# Altium project RMCBackplane.PrjPcb
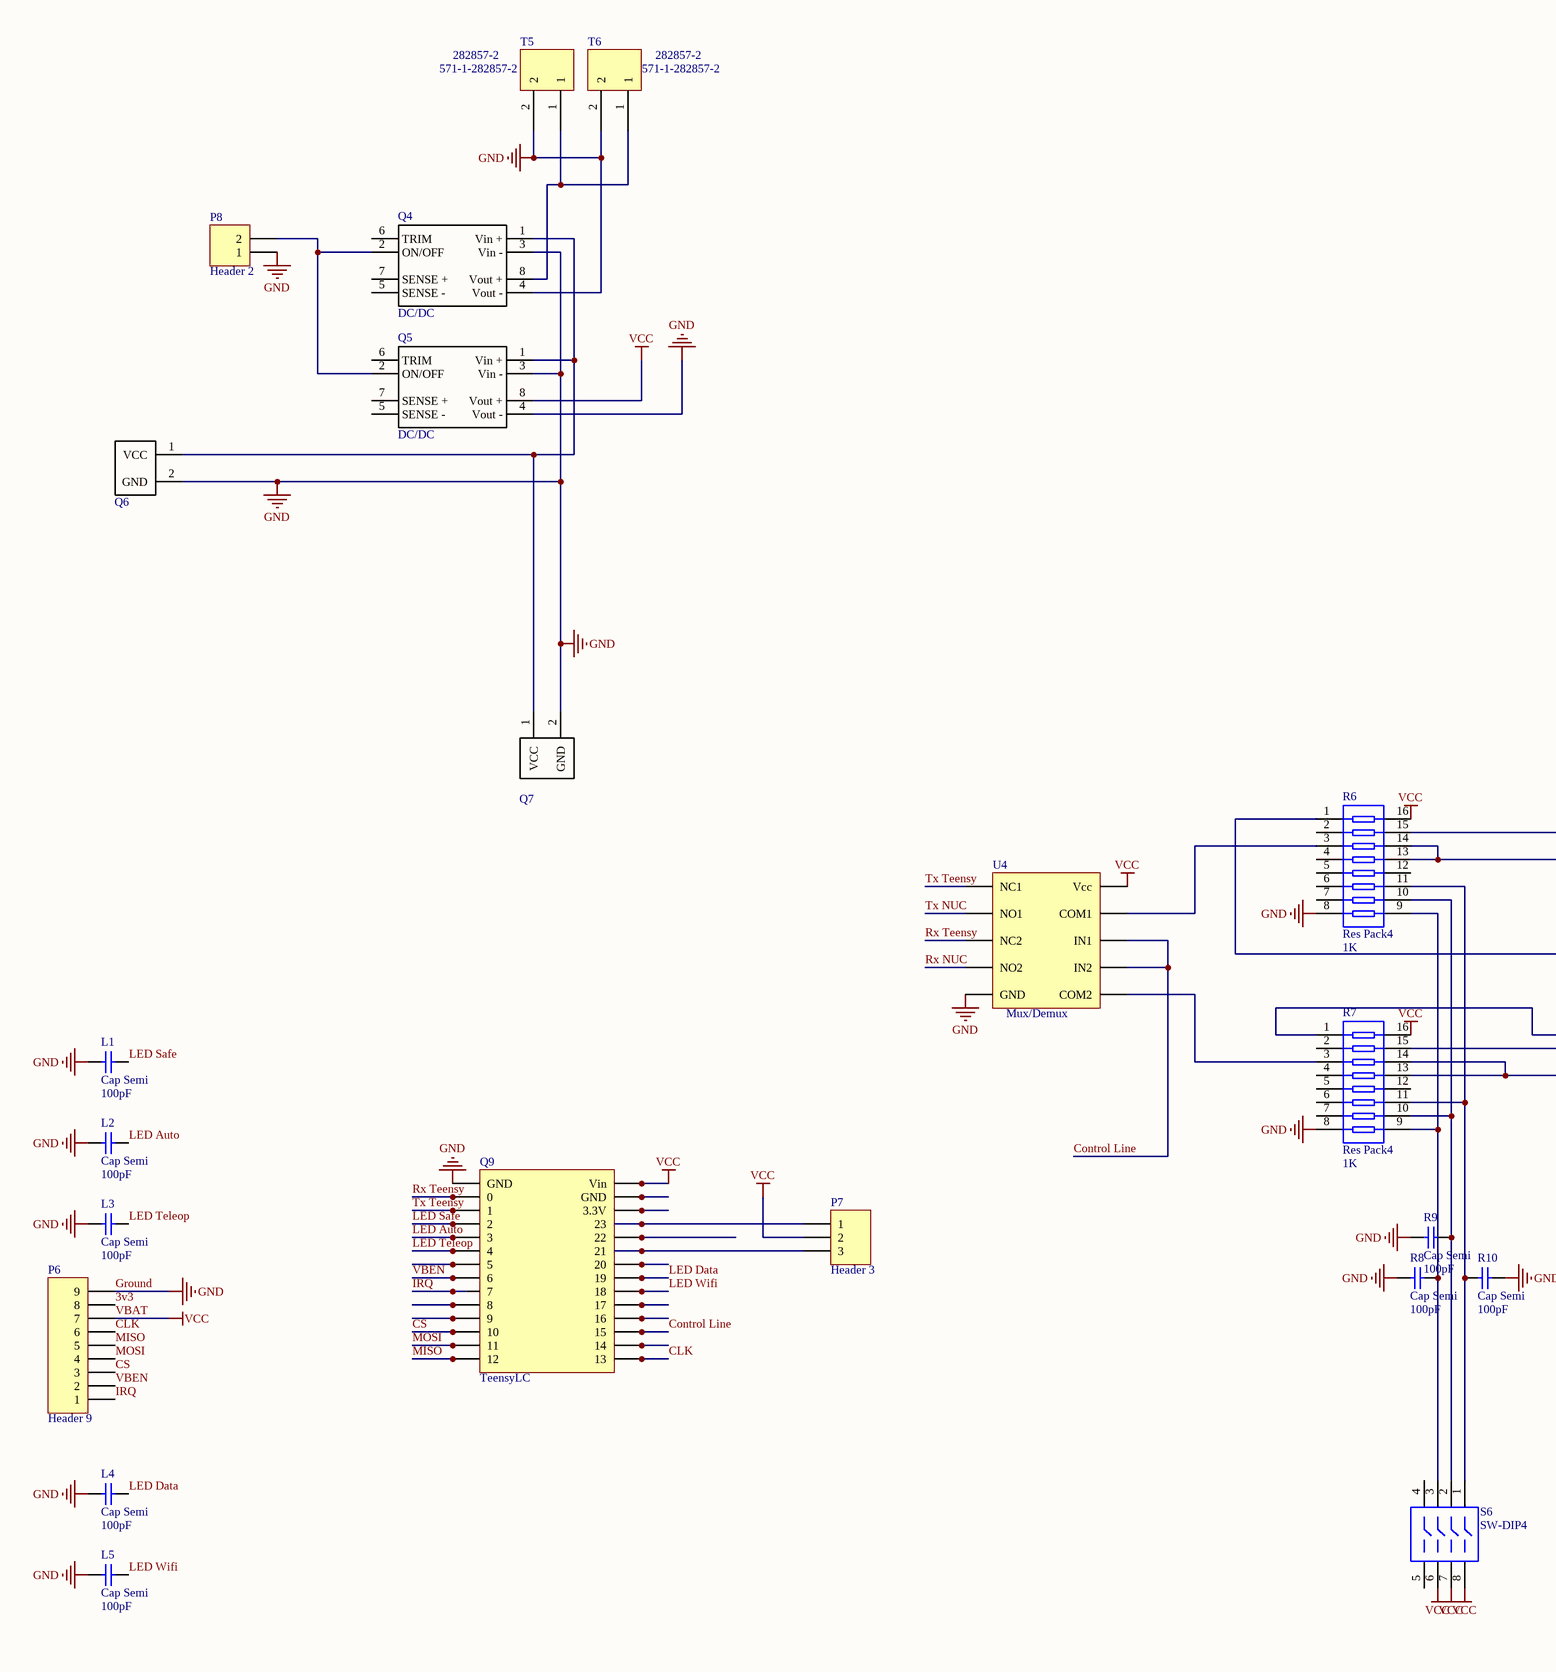
[diagram p0: RMC Backplane.SchDoc, left]
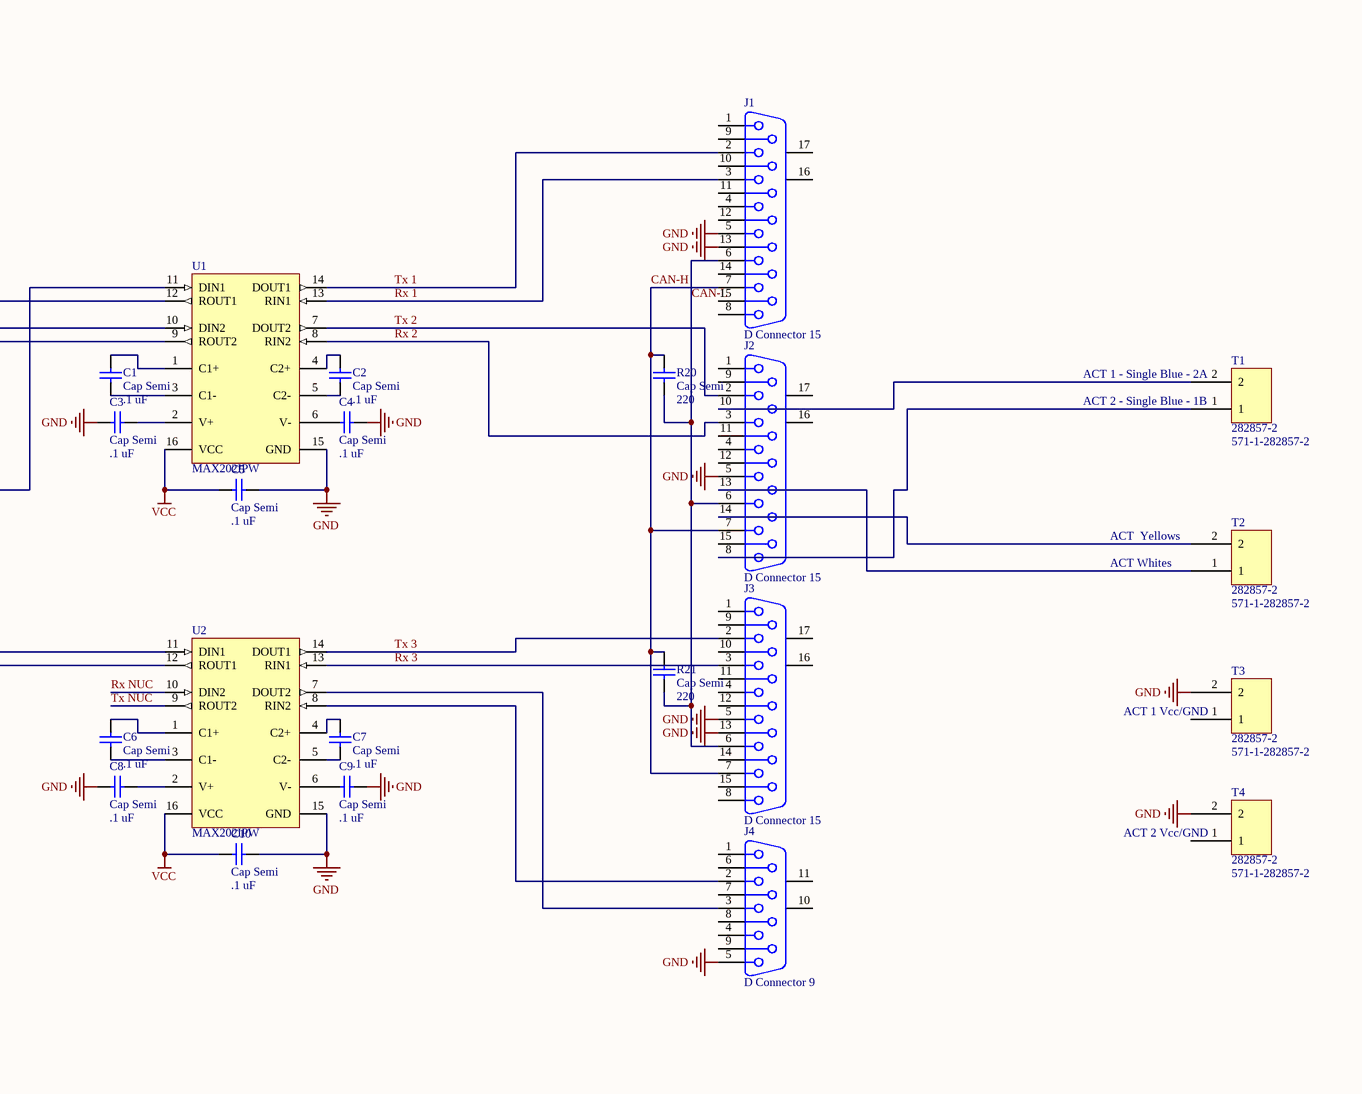
[diagram p1: RMC Backplane.SchDoc, right]
1 sheet, 44 parts. Net scope: global (net labels, ports and power ports of the same name join across sheets).
Board file: RMC Backplane PCB.PcbDoc

## Sheet RMC Backplane.SchDoc
size 635 x 381 mm

### Parts
C1  Cap Semi  value .1 uF  [C1206]
C2  Cap Semi  value .1 uF  [C1206]
C3  Cap Semi  value .1 uF  [C1206]
C4  Cap Semi  value .1 uF  [C1206]
C5  Cap Semi  value .1 uF  [C1206]
C6  Cap Semi  value .1 uF  [C1206]
C7  Cap Semi  value .1 uF  [C1206]
C8  Cap Semi  value .1 uF  [C1206]
C9  Cap Semi  value .1 uF  [C1206]
C10  Cap Semi  value .1 uF  [C1206]
J1  D Connector 15  [DSUB1.385-2H15]
J2  D Connector 15  [DSUB1.385-2H15]
J3  D Connector 15  [DSUB1.385-2H15]
J4  D Connector 9  [DSUB1.385-2H9]
L1  Cap Semi  value 100pF  [C1206]
L2  Cap Semi  value 100pF  [C1206]
L3  Cap Semi  value 100pF  [C1206]
L4  Cap Semi  value 100pF  [C1206]
L5  Cap Semi  value 100pF  [C1206]
P6  Header 9  [HDR1X9]
P7  Header 3  [HDR1X3]
P8  Header 2  [HDR1X2]
Q4  DC/DC  [EHHD]
Q5  DC/DC  [EHHD]
Q6  Power Conn  [Mini-Fit Power Conn]  (value not drawn)
Q7  Power Conn  [Mini-Fit Power Conn]  (value not drawn)
Q9  TeensyLC  [TeensyLC]
R6  Res Pack4  value 1K  [SSOP16_N]
R7  Res Pack4  value 1K  [SSOP16_N]
R8  Cap Semi  value 100pF  [C1206]
R9  Cap Semi  value 100pF  [C1206]
R10  Cap Semi  value 100pF  [C1206]
R20  Cap Semi  value 220  [C1206]
R21  Cap Semi  value 220  [C1206]
S6  SW-DIP4  [DIP-8]
T1  282857-2  Supplier Part Number 1: 571-1-282857-2  [282857-2]
T2  282857-2  Supplier Part Number 1: 571-1-282857-2  [282857-2]
T3  282857-2  Supplier Part Number 1: 571-1-282857-2  [282857-2]
T4  282857-2  Supplier Part Number 1: 571-1-282857-2  [282857-2]
T5  282857-2  Supplier Part Number 1: 571-1-282857-2  [282857-2]
T6  282857-2  Supplier Part Number 1: 571-1-282857-2  [282857-2]
U1  MAX202IPW  [TI-PW16_N]
U2  MAX202IPW  [TI-PW16_N]
U4  Mux/Demux  [TS3A24157]

### Nets
Ground: C3.1 C4.2 C5.2 C8.1 C9.2 C10.2 J1.5 J1.13 J2.5 J3.5 J3.13 J4.5 L1.1 L2.1 L3.1 L4.1 L5.1 P6.9 P8.1 Q4.3(Vin_-) Q4.4(Vout_-) Q5.3(Vin_-) Q5.4(Vout_-) Q6.2(GND) Q7.2(GND) Q9.1(GND) R6.8 R7.8 R8.1 R9.1 R10.2 T3.2 T4.2 T5.2 T6.2 U1.15(GND) U2.15(GND) U4.5(GND)  [also labelled GND]
VBAT: C5.1 C10.1 P6.7 P7.2 Q5.8(Vout_+) Q9.28(Vin) R6.16 R7.16 S6.6 S6.7 S6.8 U1.16(VCC) U2.16(VCC) U4.10(Vcc)  [also labelled VCC]
3v3: P6.8
CAN-H: J1.7 J2.7 J3.7 R20.1 R21.1
CAN-L: J1.6 J2.6 J3.6 R20.2 R21.2
CLK: P6.6 Q9.15(13)
Control Line: Q9.17(15) U4.7(IN2) U4.8(IN1)
CS: P6.3 Q9.12(10)
IRQ: P6.1 Q9.9(7)
LED Auto: L2.2 Q9.5(3)
LED Data: L4.2 Q9.21(19)
LED Safe: L1.2 Q9.4(2)
LED Teleop: L3.2 Q9.6(4)
LED Wifi: L5.2 Q9.20(18)
MISO: P6.5 Q9.14(12)
MOSI: P6.4 Q9.13(11)
Rx 1: J1.3 U1.13(RIN1)
Rx 2: J2.3 U1.8(RIN2)
Rx 3: J3.3 U2.13(RIN1)
Rx NUC: U2.10(DIN2) U4.4(NO2)
Rx Teensy: Q9.2(0) U4.3(NC2)
Tx 1: J1.2 U1.14(DOUT1)
Tx 2: J2.2 U1.7(DOUT2)
Tx 3: J3.2 U2.14(DOUT1)
Tx NUC: U2.9(ROUT2) U4.2(NO1)
Tx Teensy: Q9.3(1) U4.1(NC1)
VBEN: P6.2 Q9.8(6)
NetC1_1: C1.1 U1.1(C1+)
NetC1_2: C1.2 U1.3(C1-)
NetC2_1: C2.1 U1.4(C2+)
NetC2_2: C2.2 U1.5(C2-)
NetC3_2: C3.2 U1.2(V+)
NetC4_1: C4.1 U1.6(V-)
NetC6_1: C6.1 U2.1(C1+)
NetC6_2: C6.2 U2.3(C1-)
NetC7_1: C7.1 U2.4(C2+)
NetC7_2: C7.2 U2.5(C2-)
NetC8_2: C8.2 U2.2(V+)
NetC9_1: C9.1 U2.6(V-)
NetJ2_8: J2.8 T1.1
NetJ2_10: J2.10 T1.2
NetJ2_13: J2.13 T2.1
NetJ2_14: J2.14 T2.2
NetJ4_2: J4.2 U2.8(RIN2)
NetJ4_3: J4.3 U2.7(DOUT2)
NetP7_1: P7.1 Q9.25(23)
NetP7_3: P7.3 Q9.23(21)
NetP8_2: P8.2 Q4.2(ON/OFF) Q5.2(ON/OFF)
NetQ4_1: Q4.1(Vin_+) Q5.1(Vin_+) Q6.1(VCC) Q7.1(VCC)
NetQ4_8: Q4.8(Vout_+) T5.1 T6.1
NetR6_1: R6.1 U2.11(DIN1)
NetR6_3: R6.3 U4.9(COM1)
NetR6_9: R6.9 R7.9 R8.2 S6.3
NetR6_10: R6.10 R7.10 R9.2 S6.2
NetR6_11: R6.11 R7.11 R10.1 S6.1
NetR6_13: R6.13 R6.14 U1.11(DIN1)
NetR6_15: R6.15 U1.10(DIN2)
NetR7_1: R7.1 U2.12(ROUT1)
NetR7_3: R7.3 U4.6(COM2)
NetR7_13: R7.13 R7.14 U1.12(ROUT1)
NetR7_15: R7.15 U1.9(ROUT2)

Not connected (* = marked no-connect by the designer): J1 1 4 8 9 10 11 12 14 15 16(MH1) 17(MH2); J2 1 4 9 11 12 15 16(MH1) 17(MH2); J3 1 4 8 9 10 11 12 14 15 16(MH1) 17(MH2); J4 1 4 6 7 8 9 10(MH1) 11(MH2); Q4 5(SENSE_-) 6(TRIM) 7(SENSE_+); Q5 5(SENSE_-) 6(TRIM) 7(SENSE_+); Q9 7(5) 10(8) 11(9) 16(14) 18(16) 19(17) 22(20) 24(22) 26(3.3V) 27(GND); R6 2 4 5 6 7 12; R7 2 4 5 6 7 12; S6 4 5; T3 1; T4 1

### Notes on the sheet
- (near T1) ACT 1 - Single Blue - 2A
- (near T1) ACT 2 - Single Blue - 1B
- ACT Whites
- (near T2) ACT  Yellows
- (near T3) ACT 1 Vcc/GND
- (near T4) ACT 2 Vcc/GND

### Library data of the parts
C1-C10 L1-L5 R8-R10 R20 R21 = Cap Semi: Capacitor (Semiconductor SIM Model); Published: 8-Jun-2000; LatestRevisionDate: 29-May-2009; LatestRevisionNote: IPC-7351 Footprint Added.; PackageReference: C1206; Publisher: Altium Limited; PackageDescription: Chip Capacitor
J1-J3 = D Connector 15: Receptacle Assembly, 15 Position, Right Angle; PackageDocument: O; Positions: 15; Published: 15-Jun-2001; LatestRevisionDate: 17-Jul-2002; LatestRevisionNote: Re-released for DXP Platform.; DatasheetDocument: 1-Sep-99; PackageReference: 788757; Publisher: Altium Limited; Orientation: Right Angle; Gender: Receptacle
J4 = D Connector 9: Receptacle Assembly, 9 Position, Right Angle; PackageDocument: O; Positions: 9; Published: 15-Jun-2001; LatestRevisionDate: 17-Jul-2002; LatestRevisionNote: Re-released for DXP Platform.; DatasheetDocument: 1-Sep-1999; PackageReference: 788750; Publisher: Altium Limited; Orientation: Right Angle; Gender: Receptacle
P6 = Header 9: Header, 9-Pin; LatestRevisionDate: 17-Jul-2002; LatestRevisionNote: Re-released for DXP Platform.; Publisher: Altium Limited
P7 = Header 3: Header, 3-Pin; LatestRevisionDate: 17-Jul-2002; LatestRevisionNote: Re-released for DXP Platform.; Publisher: Altium Limited
P8 = Header 2: Header, 2-Pin; LatestRevisionDate: 17-Jul-2002; LatestRevisionNote: Re-released for DXP Platform.; Publisher: Altium Limited
Q4 Q5 = EHHD: Voltage Regulator
Q6 Q7 = Mini-Fit Power Conn: Mini-Fit Molex Connector
R6 R7 = Res Pack4: Isolated Resistor Network; Published: 24-Mar-1999; LatestRevisionDate: 29-May-2009; LatestRevisionNote: IPC-7351 Footprint Added.; PackageVersion: Oct-2003; PackageReference: SSOP16; Publisher: Altium Limited; PackageDescription: 16-Pin Plastic Small Outline Package 0.65 mm Pitch; Code_JEDEC: MO-150-AC; Code_IPC: SOP65P780-16
S6 = SW-DIP4: DIP Switch; Published: 24-Mar-1999; LatestRevisionDate: 17-Jul-2002; LatestRevisionNote: Re-released for DXP Platform.; PackageReference: DIP-8; Publisher: Altium Limited
U1 U2 = MAX202IPW: 5-V Dual RS-232 Line Driver / Receiver with ±15-kV ESD Protection, -40 to 85 degC, 16-Pin TSSOP (PW), Green (RoHS & no Sb/Br); Drivers Per Package: 2; Supply Voltage(s)(V): 5; ESD HBM(kV): +/-15; ICC(Max)(mA): 15; Single Supply: TRUE; DatasheetVersion: SLLS576E; PackageVersion: revG, Feb-2011; PackageReference: PW16; PackageDescription: 16-Pin Plastic Thin Small Outline Package 5 x 4.4 mm Body ,0.65 mm Pitch; SubFamily: RS-232; Receivers Per Package: 2; RS-232: TRUE; ComponentLink1Description: Manufacturer URL; ComponentLink1URL: www.ti.com; ComponentLink2Description: Datasheet; ComponentLink2URL: http://www.ti.com/general/docs/lit/getliterature.tsp?genericPartNumber=MAX202&fileType=pdf; ComponentLink3Description: Package Specification; ComponentLink3URL: http://www.ti.com/litv/pdf/mpds361
T1-T6 = 282857-2: Supplier 1: Mouser